# Altium schematic sheet CH32V103R-R0.SchDoc
size 304 x 203 mm
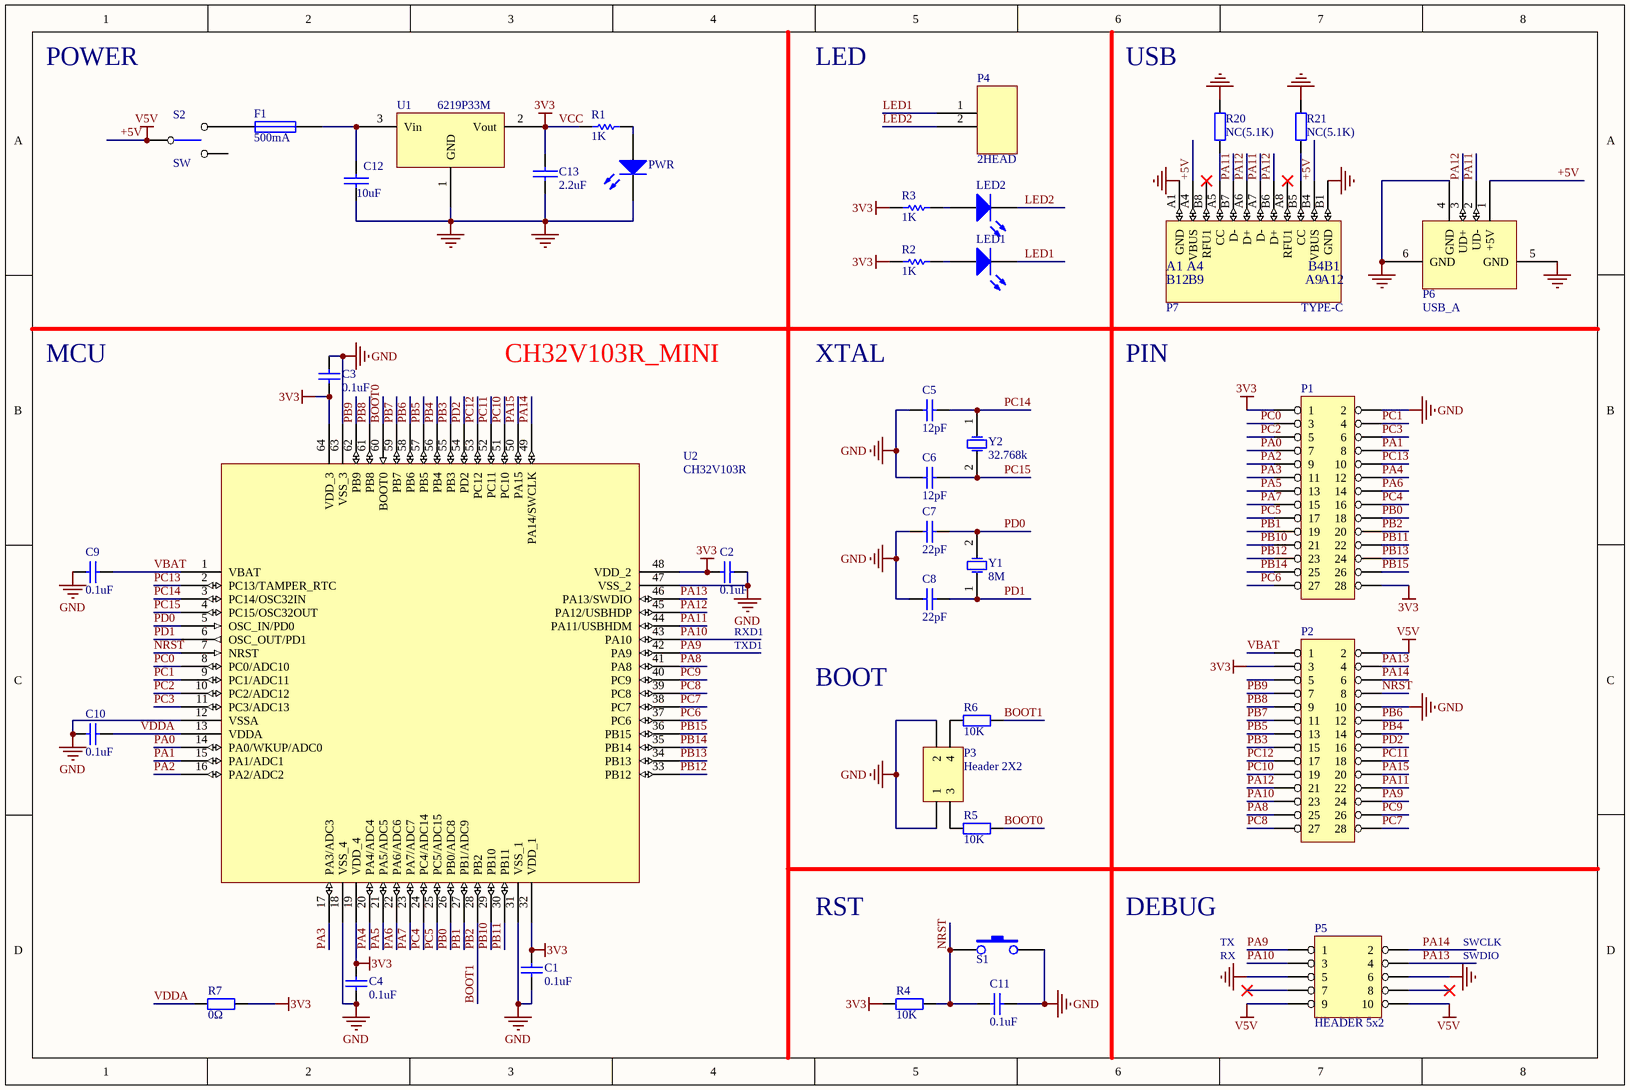
[diagram p0: CH32V103R-R0.SchDoc]

## Parts
C1  0.1uF  [0603_C]
C2  0.1uF  [0603_C]
C3  0.1uF  [0603_C]
C4  0.1uF  [0603_C]
C5  12pF  [0603_C]
C6  12pF  [0603_C]
C7  22pF  [0603_C]
C8  22pF  [0603_C]
C9  0.1uF  [0603_C]
C10  0.1uF  [0603_C]
C11  0.1uF  [0603_C]
C12  10uF  [3216_C]
C13  2.2uF  [0603_C]
F1  500mA  [0603]
LED1  LED1   blue  [0603+]  (value not drawn)
LED2  LED2  blue  [0603+]  (value not drawn)
P1  HEADER 14x2  [IDC28-2.54MM]  (value not drawn)
P2  HEADER 14x2  [IDC28-2.54MM]  (value not drawn)
P3  Header 2X2  [IDC4-2.54mm]
P4  2HEAD  [SIP2-2.54mm]
P5  HEADER 5x2  [IDC10-2.54mm]
P6  USB_A  [USBAF]
P7  TYPE-C  [TYPE-C-Receptacle-2.0]
PWR  POWER  red  [0603+]  (value not drawn)
R1  1K  [0603]
R2  1K  [0603]
R3  1K  [0603]
R4  10K  [0603]
R5  10K  [0603]
R6  10K  [0603]
R7  0Ω  [0603]
R20  NC(5.1K)  [0603]
R21  NC(5.1K)  [0603]
S1  KEY  [贴片按键]  (value not drawn)
S2  SW  [KEY2]
U1  6219P33M  [SOT-23]
U2  CH32V103R  [LQFP64M_10X10]
Y1  8M  [XT_AT49]
Y2  32.768k  [FC-135]

## Nets
+5V: P2.2 P5.9 P5.10 P6.1(+5V) P7.A4(VBUS) P7.B4(VBUS) S2.1  [also labelled V5V]
GND: C1.1 C2.1 C3.1 C4.1 C5.2 C6.2 C7.1 C8.1 C9.2 C10.2 C11.1 C12.2 C13.2 P1.2 P2.10 P3.1 P3.2 P5.5 P5.6 P6.4(GND) P6.5(GND) P6.6(GND) P7.A1(GND) P7.B1(GND) PWR.2(K) R20.2 R21.2 S1.3 U1.1(GND) U2.12(VSSA) U2.18(VSS_4) U2.31(VSS_1) U2.47(VSS_2) U2.63(VSS_3)
VCC: C1.2 C2.2 C3.2 C4.2 C13.1 P1.1 P1.28 P2.3 R1.2 R2.1 R3.1 R4.2 R7.1 U1.2(Vout) U2.19(VDD_4) U2.32(VDD_1) U2.48(VDD_2) U2.64(VDD_3)  [also labelled 3V3]
BOOT0: R5.1 U2.60(BOOT0)
BOOT1: P1.20 R6.1 U2.28(PB2)  [also labelled PB2]
LED1: LED1.2(K) P4.1
LED2: LED2.2(K) P4.2
NRST: C11.2 P2.8 R4.1 S1.1 U2.7(NRST)
PA0: P1.7 U2.14(PA0/WKUP/ADC0)
PA1: P1.8 U2.15(PA1/ADC1)
PA2: P1.9 U2.16(PA2/ADC2)
PA3: P1.11 U2.17(PA3/ADC3)
PA4: P1.12 U2.20(PA4/ADC4)
PA5: P1.13 U2.21(PA5/ADC5)
PA6: P1.14 U2.22(PA6/ADC6)
PA7: P1.15 U2.23(PA7/ADC7)
PA8: P2.25 U2.41(PA8)
PA9: P2.24 P5.1 U2.42(PA9)
PA10: P2.23 P5.3 U2.43(PA10)
PA11: P2.22 P6.2(UD-) P7.A7(D-) P7.B7(D-) U2.44(PA11/USBHDM)
PA12: P2.21 P6.3(UD+) P7.A6(D+) P7.B6(D+) U2.45(PA12/USBHDP)
PA13: P2.4 P5.4 U2.46(PA13/SWDIO)
PA14: P2.6 P5.2 U2.49(PA14/SWCLK)
PA15: P2.20 U2.50(PA15)
PB0: P1.18 U2.26(PB0/ADC8)
PB1: P1.19 U2.27(PB1/ADC9)
PB3: P2.15 U2.55(PB3)
PB4: P2.14 U2.56(PB4)
PB5: P2.13 U2.57(PB5)
PB6: P2.12 U2.58(PB6)
PB7: P2.11 U2.59(PB7)
PB8: P2.9 U2.61(PB8)
PB9: P2.7 U2.62(PB9)
PB10: P1.21 U2.29(PB10)
PB11: P1.22 U2.30(PB11)
PB12: P1.23 U2.33(PB12)
PB13: P1.24 U2.34(PB13)
PB14: P1.25 U2.35(PB14)
PB15: P1.26 U2.36(PB15)
PC0: P1.3 U2.8(PC0/ADC10)
PC1: P1.4 U2.9(PC1/ADC11)
PC2: P1.5 U2.10(PC2/ADC12)
PC3: P1.6 U2.11(PC3/ADC13)
PC4: P1.16 U2.24(PC4/ADC14)
PC5: P1.17 U2.25(PC5/ADC15)
PC6: P1.27 U2.37(PC6)
PC7: P2.28 U2.38(PC7)
PC8: P2.27 U2.39(PC8)
PC9: P2.26 U2.40(PC9)
PC10: P2.19 U2.51(PC10)
PC11: P2.18 U2.52(PC11)
PC12: P2.17 U2.53(PC12)
PC13: P1.10 U2.2(PC13/TAMPER_RTC)
PC14: C5.1 U2.3(PC14/OSC32IN) Y2.1(OSC1)
PC15: C6.1 U2.4(PC15/OSC32OUT) Y2.2(OSC2)
PD0: C7.2 U2.5(OSC_IN/PD0) Y1.2(OSC2)
PD1: C8.2 U2.6(OSC_OUT/PD1) Y1.1(OSC1)
PD2: P2.16 U2.54(PD2)
VBAT: C9.1 P2.1 U2.1(VBAT)
VDDA: C10.1 R7.2 U2.13(VDDA)
NetC12_1: C12.1 F1.2 U1.3(Vin)
NetF1_1: F1.1 S2.3
NetLED1_1: LED1.1(A) R2.2
NetLED2_1: LED2.1(A) R3.2
NetP3_3: P3.3 R5.2
NetP3_4: P3.4 R6.2
NetP7_A5: P7.A5(CC) R20.1
NetP7_B5: P7.B5(CC) R21.1
NetPWR_1: PWR.1(A) R1.1

Not connected (* = marked no-connect by the designer): P2 5; P5 7* 8*; P7 A8(RFU1)* B8(RFU1)*; S2 2

## Notes on the sheet
- POWER
- LED
- USB
- MCU
- CH32V103R_MINI
- XTAL
- PIN
- RXD1
- TXD1
- BOOT
- RST
- DEBUG
- RX
- TX
- SWCLK
- SWDIO
- Title
- Size:
- Date:
- A3
- Number:
- Time:
- Revision:
- Sheet
- of
- File:
- (in symbol TYPE-C1) B12; B9; A9; A12

## Library data of the parts
C1-C4 C9 C10 = Cap: Capacitor; Value: 15pF; Published: 8-Jun-2000; LatestRevisionDate: 17-Jul-2002; LatestRevisionNote: Re-released for DXP Platform.; PackageReference: RAD-0.3; Publisher: Altium Limited
C5-C8 C11 = Cap: Capacitor; Published: 8-Jun-2000; LatestRevisionDate: 17-Jul-2002; LatestRevisionNote: Re-released for DXP Platform.; PackageReference: RAD-0.3; Publisher: Altium Limited
  C11: Value: 0.1uF
C12 C13 = CAP: Capacitor
F1 = FUSE1: Fuse
LED1 LED2 PWR = LED0: Typical INFRARED GaAs LED; Published: 8-Jun-2000; LatestRevisionDate: 08-Jul-2005; LatestRevisionNote: Mech Layer 1 removed.; PackageReference: LED-0; Publisher: Altium Limited
P1 P2 = HEADER 14x2: Header, 14-Pin, Dual row
P3 = Header 2X2: Header, 2-Pin, Dual row; LatestRevisionDate: 17-Jul-2002; LatestRevisionNote: Re-released for DXP Platform.; Publisher: Altium Limited
P5 = HEADER 5x2: Header, 4-Pin, Dual row
P6 = USB: USB Port
P7 = TYPE-C1
R1-R3 = Res Semi: Semiconductor Resistor; Published: 8-Jun-2000; LatestRevisionDate: 17-Jul-2002; LatestRevisionNote: Re-released for DXP Platform.; PackageReference: AXIAL-0.5; Publisher: Altium Limited; Value: 1K
R4-R6 R20 R21 = Res2: Resistor
  R4-R6: Published: 8-Jun-2000; LatestRevisionDate: 17-Jul-2002; LatestRevisionNote: Re-released for DXP Platform.; PackageReference: AXIAL-0.4; Publisher: Altium Limited; Value: 10K
R7 = Res2: Resistor; Value: 10K; Published: 8-Jun-2000; LatestRevisionDate: 17-Jul-2002; LatestRevisionNote: Re-released for DXP Platform.; PackageReference: AXIAL-0.4; Publisher: Altium Limited
U2 = CH32V103R: RISC-V MCU with USB device & USB host & ADC & Touch Key
Y1 Y2 = XTAL: Crystal Oscillator; Published: 8-Jun-2000; LatestRevisionDate: 17-Jul-2002; LatestRevisionNote: Re-released for DXP Platform.; PackageReference: R38; Publisher: Altium Limited